# Altium schematic sheet MPU6050.SchDoc
size A4
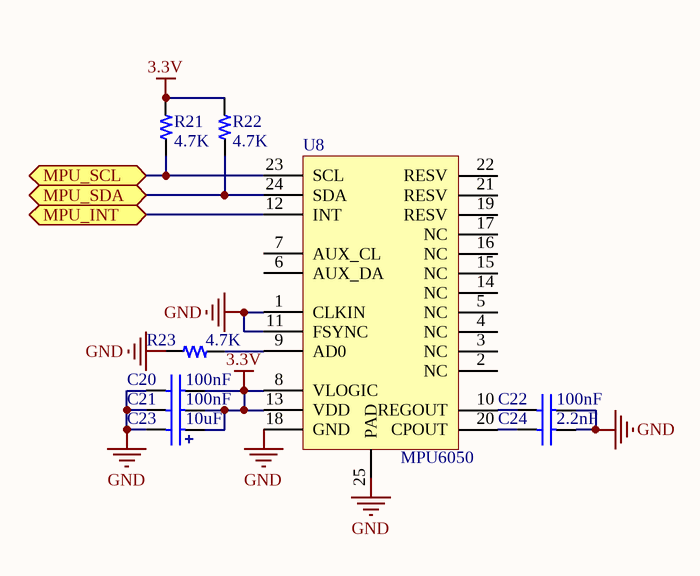
[diagram p0: MPU6050.SchDoc]

## Parts
C20  value 100nF  [dq - 0402]  (hidden comment: Cap)
C21  value 100nF  [dq - 0402]  (hidden comment: Cap)
C22  value 100nF  [dq - 0402]  (hidden comment: Cap)
C23  value 10uF  [3216-18]  (hidden comment: Cap_Pol)
C24  value 2.2nF  [dq - 0402]  (hidden comment: Cap)
R21  value 4.7K  [dq - 0402]  (hidden comment: Res)
R22  value 4.7K  [dq - 0402]  (hidden comment: Res)
R23  value 4.7K  [dq - 0402]  (hidden comment: Res)
U8  MPU6050  [QFN-24]

## Ports
MPU_INT, MPU_SCL, MPU_SDA

## Nets
3.3V: C20.2 C21.2 C23.1 R21.1 R22.1 U8.8(VLOGIC) U8.13(VDD)
GND: C20.1 C21.1 C22.2 C23.2 C24.2 R23.1 U8.1(CLKIN) U8.11(FSYNC) U8.18(GND) U8.25(PAD)
MPU_INT: U8.12(INT) ; port MPU_INT
MPU_SCL: R21.2 U8.23(SCL) ; port MPU_SCL
MPU_SDA: R22.2 U8.24(SDA) ; port MPU_SDA
NetC22_1: C22.1 U8.10(REGOUT)
NetC24_1: C24.1 U8.20(CPOUT)
NetR23_2: R23.2 U8.9(AD0)

Not connected (* = marked no-connect by the designer): U8 2(NC) 3(NC) 4(NC) 5(NC) 6(AUX_DA) 7(AUX_CL) 14(NC) 15(NC) 16(NC) 17(NC) 19(RESV) 21(RESV) 22(RESV)

## Library data of the parts
C20-C22 C24 = DQ_Cap: Capacitor; Published: 8-Jun-2000; LatestRevisionDate: 17-Jul-2002; LatestRevisionNote: Re-released for DXP Platform.; PackageReference: RAD-0.3; Publisher: Altium Limited
C23 = Cap_Pol: Capacitor; Published: 8-Jun-2000; LatestRevisionDate: 17-Jul-2002; LatestRevisionNote: Re-released for DXP Platform.; PackageReference: RAD-0.3; Publisher: Altium Limited
R21-R23 = DQ_Res: Resistance